# Altium schematic sheet StEth32_modLED_W5500.SchDoc
size A4
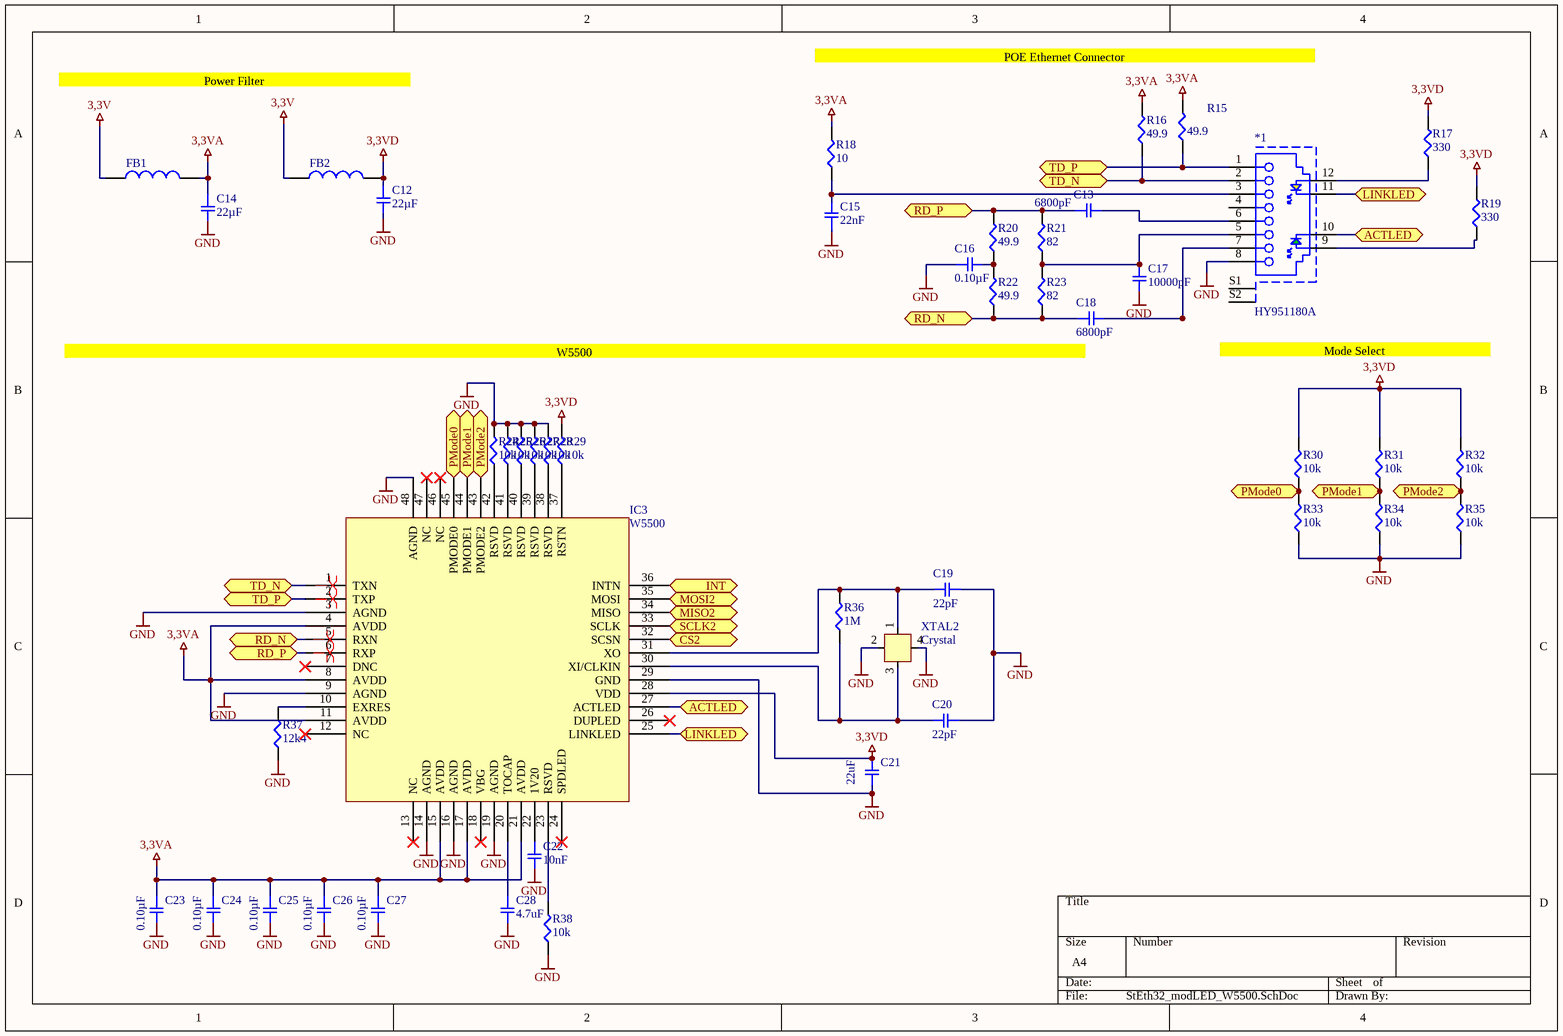
[diagram p0: StEth32_modLED_W5500.SchDoc]

## Parts
*1  HY951180A  [HY951180A]
C12  22µF  [SMD-0603C]
C13  6800pF  [SMD-0603C]
C14  22µF  [SMD-0603C]
C15  22nF  [SMD-0603C]
C16  0.10µF  [SMD-0603C]
C17  10000pF  [SMD-0603C]
C18  6800pF  [SMD-0603C]
C19  22pF  [SMD-0603C]
C20  22pF  [SMD-0603C]
C21  22uF  [SMD-0603C]
C22  10nF  [SMD-0603C]
C23  0.10µF  [SMD-0603C]
C24  0.10µF  [SMD-0603C]
C25  0.10µF  [SMD-0603C]
C26  0.10µF  [SMD-0603C]
C27  0.10µF  [SMD-0603C]
C28  4.7uF  [SMD-0603C]
FB1  600Ohm, 0.2A  [WE-CBF_0805_High Speed]  (value not drawn)
FB2  600Ohm, 0.2A  [WE-CBF_0805_High Speed]  (value not drawn)
IC3  W5500  [LQFP-48]
R15  49.9  [SMD-0603-RES]
R16  49.9  [SMD-0603-RES]
R17  330  [SMD-0603-RES]
R18  10  [SMD-0603-RES]
R19  330  [SMD-0603-RES]
R20  49.9  [SMD-0603-RES]
R21  82  [SMD-0603-RES]
R22  49.9  [SMD-0603-RES]
R23  82  [SMD-0603-RES]
R24  10k  [SMD-0603-RES]
R25  10k  [SMD-0603-RES]
R26  10k  [SMD-0603-RES]
R27  10k  [SMD-0603-RES]
R28  10k  [SMD-0603-RES]
R29  10k  [SMD-0603-RES]
R30  10k  [SMD-0603-RES]
R31  10k  [SMD-0603-RES]
R32  10k  [SMD-0603-RES]
R33  10k  [SMD-0603-RES]
R34  10k  [SMD-0603-RES]
R35  10k  [SMD-0603-RES]
R36  1M  [SMD-0402-RES]
R37  12k4  [SMD-0603-RES]
R38  10k  [SMD-0603-RES]
XTAL2  Crystal  [3225]

## Ports
ACTLED (bidir), CS2 (bidir), INT (bidir), LINKLED (bidir), MISO2 (bidir), MOSI2 (bidir), PMode0 (bidir), PMode1 (bidir), PMode2 (bidir), RD_N (bidir), RD_P (bidir), SCLK2 (bidir), TD_N (bidir), TD_P (bidir)

## Nets
3,3V: FB1.1 FB2.1
3,3VA: C14.1 C23.1 C24.1 C25.1 C26.1 C27.1 FB1.2 IC3.4(AVDD) IC3.8(AVDD) IC3.11(AVDD) IC3.15(AVDD) IC3.17(AVDD) IC3.21(AVDD) R15.2 R16.2 R18.2
3,3VD: C12.1 C21.1 FB2.2 IC3.28(VDD) R17.2 R19.2 R29.2 R30.2 R31.2 R32.2
GND: *1.8 C12.2 C14.2 C15.1 C16.1 C17.2 C19.1 C20.1 C21.2 C22.2 C23.2 C24.2 C25.2 C26.2 C27.2 C28.2 IC3.3(AGND) IC3.9(AGND) IC3.14(AGND) IC3.16(AGND) IC3.19(AGND) IC3.29(GND) IC3.48(AGND) R24.2 R25.2 R26.2 R27.2 R28.2 R33.1 R34.1 R35.1 R37.1 R38.1 XTAL2.2 XTAL2.4
ACTLED: *1.10 IC3.27(ACTLED) ; port ACTLED
CS2: IC3.32(SCSN) ; port CS2
INT: IC3.36(INTN) ; port INT
LINKLED: *1.11 IC3.25(LINKLED) ; port LINKLED
MISO2: IC3.34(MISO) ; port MISO2
MOSI2: IC3.35(MOSI) ; port MOSI2
PMode0: IC3.45(PMODE0) R30.1 R33.2 ; port PMode0
PMode1: IC3.44(PMODE1) R31.1 R34.2 ; port PMode1
PMode2: IC3.43(PMODE2) R32.1 R35.2 ; port PMode2
RD_N: C18.1 IC3.5(RXN) R22.1 R23.1 ; port RD_N
RD_P: C13.1 IC3.6(RXP) R20.2 R21.2 ; port RD_P
SCLK2: IC3.33(SCLK) ; port SCLK2
TD_N: *1.2 IC3.1(TXN) R16.1 ; port TD_N
TD_P: *1.1 IC3.2(TXP) R15.1 ; port TD_P
Net*1_3: *1.3 C15.2 R18.1
Net*1_5: *1.5 C17.1 R21.1 R23.2
Net*1_6: *1.6 C13.2
Net*1_7: *1.7 C18.2
Net*1_9: *1.9 R19.1
Net*1_12: *1.12 R17.1
NetC16_2: C16.2 R20.1 R22.2
NetC19_2: C19.2 IC3.31(XO) R36.2 XTAL2.1
NetC20_2: C20.2 IC3.30(XI/CLKIN) R36.1 XTAL2.3
NetC22_1: C22.1 IC3.22(1V20)
NetC28_1: C28.1 IC3.20(TOCAP)
NetIC3_10: IC3.10(EXRES) R37.2
NetIC3_23: IC3.23(RSVD) R38.2
NetIC3_37: IC3.37(RSTN) R29.1
NetIC3_38: IC3.38(RSVD) R28.1
NetIC3_39: IC3.39(RSVD) R27.1
NetIC3_40: IC3.40(RSVD) R26.1
NetIC3_41: IC3.41(RSVD) R25.1
NetIC3_42: IC3.42(RSVD) R24.1

Not connected (* = marked no-connect by the designer): *1 4 S1 S2; IC3 7(DNC)* 12(NC)* 13(NC)* 18(VBG)* 24(SPDLED)* 26(DUPLED)* 46(NC)* 47(NC)*

## Layout directives
differential pair: (no net found under the mark)

## Notes on the sheet
- Power Filter
- POE Ethernet Connector
- W5500
- (near *1) Mode Select

## Library data of the parts
C12 C14 = ZRB186R60G226ME11L: CAP CER 22UF 4V X5R 0603; Manufacturer: Murata Electronics North America; Factory Stock: 0; Unit Price (USD): 0.36; Minimum Quantity: 1; Tolerance: ±20%; Datasheets: http://psearch.en.murata.com/capacitor/product/ZRB186R60G226ME11%23.pdf; Image: //media.digikey.com/Renders/Murata%20Renders/0603%20(1608%20Metric).jpg; Digi-Key Part Number: 490-13253-1-ND; Part Number: ZRB186R60G226ME11L; Quantity Available: 3925; @ qty: 0; Packaging: Cut Tape (CT); Series: ZRB; Part Status: Active; Value: 22µF; Voltage: 4V; Temperature Coefficient: X5R; Operating Temperature: -55°C ~ 85°C; Features: Interposer Termination; Ratings: -; Applications: Acoustic Noise Reduction; Mounting Type: Surface Mount, MLCC; Package / Case: 0603 (1608 Metric); Size / Dimension: 0.063" L x 0.031" W (1.60mm x 0.80mm); Height - Seated (Max): -; Thickness (Max): 0.031" (0.80mm); Lead Spacing: -; Lead Style: -
C13 C18 = GCM188R71H682KA37D: CAP CER 6800PF 50V X7R 0603; Manufacturer: Murata Electronics North America; Factory Stock: 0; Unit Price (USD): 0.1; Minimum Quantity: 1; Tolerance: ±10%; Datasheets: http://www.murata.com/~/media/webrenewal/support/library/catalog/products/capacitor/mlcc/c03e.ashx; Image: //media.digikey.com/Renders/Murata%20Renders/0603%28GCM188%29.jpg; Digi-Key Part Number: 490-6055-1-ND; Part Number: GCM188R71H682KA37D; Quantity Available: 31753; @ qty: 0; Packaging: Cut Tape (CT); Series: GCM; Part Status: Active; Value: 6800pF; Voltage: 50V; Temperature Coefficient: X7R; Operating Temperature: -55°C ~ 125°C; Features: -; Ratings: AEC-Q200; Applications: Automotive; Mounting Type: Surface Mount, MLCC; Package / Case: 0603 (1608 Metric); Size / Dimension: 0.063" L x 0.031" W (1.60mm x 0.80mm); Height - Seated (Max): -; Thickness (Max): 0.035" (0.90mm); Lead Spacing: -; Lead Style: -
C15 C19 C20 = GCM188R72A223KA37D: CAP CER 0.022UF 100V X7R 0603; Manufacturer: Murata Electronics North America; Factory Stock: 0; Unit Price (USD): 0.11; Minimum Quantity: 1; Tolerance: ±10%; Datasheets: http://www.murata.com/~/media/webrenewal/support/library/catalog/products/capacitor/mlcc/c03e.ashx; Image: //media.digikey.com/Renders/Murata%20Renders/0603%28GCM188%29.jpg; Digi-Key Part Number: 490-4782-1-ND; Part Number: GCM188R72A223KA37D; Quantity Available: 102005; @ qty: 0; Packaging: Cut Tape (CT); Series: GCM; Part Status: Active; Voltage: 100V; Temperature Coefficient: X7R; Operating Temperature: -55°C ~ 125°C; Features: -; Ratings: AEC-Q200; Applications: Automotive; Mounting Type: Surface Mount, MLCC; Package / Case: 0603 (1608 Metric); Size / Dimension: 0.063" L x 0.031" W (1.60mm x 0.80mm); Height - Seated (Max): -; Thickness (Max): 0.035" (0.90mm); Lead Spacing: -; Lead Style: -
  C15: Value: 22nF
  C19 C20: Value: 22pF
C16 C22 = GCJ188R71C104KA01D: CAP CER 0.1UF 16V X7R 0603; Manufacturer: Murata Electronics North America; Factory Stock: 0; Unit Price (USD): 0.21; Minimum Quantity: 1; Tolerance: ±10%; Datasheets: http://www.murata.com/~/media/webrenewal/support/library/catalog/products/capacitor/mlcc/c03e.ashx; Image: //media.digikey.com/Renders/Murata%20Renders/0603%28LQG18%29.jpg; Digi-Key Part Number: 490-5796-1-ND; Part Number: GCJ188R71C104KA01D; Quantity Available: 22473; @ qty: 0; Packaging: Cut Tape (CT); Series: GCJ; Part Status: Active; Voltage: 16V; Temperature Coefficient: X7R; Operating Temperature: -55°C ~ 125°C; Features: Soft Termination; Ratings: AEC-Q200; Applications: Automotive, Boardflex Sensitive; Mounting Type: Surface Mount, MLCC; Package / Case: 0603 (1608 Metric); Size / Dimension: 0.063" L x 0.031" W (1.60mm x 0.80mm); Height - Seated (Max): -; Thickness (Max): 0.035" (0.90mm); Lead Spacing: -; Lead Style: -
  C16: Value: 0.10µF
  C22: Value: 10nF
C17 = GCJ188R71H103KA01D: CAP CER 10000PF 50V X7R 0603; Manufacturer: Murata Electronics North America; Factory Stock: 0; Unit Price (USD): 0.19; Minimum Quantity: 1; Tolerance: ±10%; Datasheets: http://www.murata.com/~/media/webrenewal/support/library/catalog/products/capacitor/mlcc/c03e.ashx; Image: //media.digikey.com/Renders/Murata%20Renders/0603%28LQG18%29.jpg; Digi-Key Part Number: 490-5762-1-ND; Part Number: GCJ188R71H103KA01D; Quantity Available: 34868; @ qty: 0; Packaging: Cut Tape (CT); Series: GCJ; Part Status: Active; Value: 10000pF; Voltage: 50V; Temperature Coefficient: X7R; Operating Temperature: -55°C ~ 125°C; Features: Soft Termination; Ratings: AEC-Q200; Applications: Automotive, Boardflex Sensitive; Mounting Type: Surface Mount, MLCC; Package / Case: 0603 (1608 Metric); Size / Dimension: 0.063" L x 0.031" W (1.60mm x 0.80mm); Height - Seated (Max): -; Thickness (Max): 0.031" (0.80mm); Lead Spacing: -; Lead Style: -
C21 = GCM188R71C104KA37J: CAP CER 0.1UF 16V X7R 0603; Manufacturer: Murata Electronics North America; Factory Stock: 0; Unit Price (USD): 0.18; Minimum Quantity: 1; Tolerance: ±10%; Voltage: 6.3V; Datasheets: http://www.murata.com/~/media/webrenewal/support/library/catalog/products/capacitor/mlcc/c03e.ashx; Image: //media.digikey.com/Renders/Murata%20Renders/0603%28GCM188%29.jpg; Digi-Key Part Number: 490-8015-1-ND; Part Number: GCM188R71C104KA37J; Quantity Available: 17844; @ qty: 0; Packaging: Cut Tape (CT); Series: GCM; Part Status: Active; Value: 22uF; Temperature Coefficient: X7R; Operating Temperature: -55°C ~ 125°C; Features: -; Ratings: AEC-Q200; Applications: Automotive; Mounting Type: Surface Mount, MLCC; Package / Case: 0603 (1608 Metric); Size / Dimension: 0.063" L x 0.031" W (1.60mm x 0.80mm); Height - Seated (Max): -; Thickness (Max): 0.035" (0.90mm); Lead Spacing: -; Lead Style: -
C23-C27 = GCM188R71C104KA37J: CAP CER 0.1UF 16V X7R 0603; Manufacturer: Murata Electronics North America; Factory Stock: 0; Unit Price (USD): 0.18; Minimum Quantity: 1; Tolerance: ±10%; Datasheets: http://www.murata.com/~/media/webrenewal/support/library/catalog/products/capacitor/mlcc/c03e.ashx; Image: //media.digikey.com/Renders/Murata%20Renders/0603%28GCM188%29.jpg; Digi-Key Part Number: 490-8015-1-ND; Part Number: GCM188R71C104KA37J; Quantity Available: 17844; @ qty: 0; Packaging: Cut Tape (CT); Series: GCM; Part Status: Active; Value: 0.10µF; Voltage: 16V; Temperature Coefficient: X7R; Operating Temperature: -55°C ~ 125°C; Features: -; Ratings: AEC-Q200; Applications: Automotive; Mounting Type: Surface Mount, MLCC; Package / Case: 0603 (1608 Metric); Size / Dimension: 0.063" L x 0.031" W (1.60mm x 0.80mm); Height - Seated (Max): -; Thickness (Max): 0.035" (0.90mm); Lead Spacing: -; Lead Style: -
C28 = GCJ188R71C104KA01D: CAP CER 0.1UF 16V X7R 0603; Manufacturer: Murata Electronics North America; Factory Stock: 0; Unit Price (USD): 0.21; Minimum Quantity: 1; Tolerance: ±10%; Voltage: 6.3V; Datasheets: http://www.murata.com/~/media/webrenewal/support/library/catalog/products/capacitor/mlcc/c03e.ashx; Image: //media.digikey.com/Renders/Murata%20Renders/0603%28LQG18%29.jpg; Digi-Key Part Number: 490-5796-1-ND; Part Number: GCJ188R71C104KA01D; Quantity Available: 22473; @ qty: 0; Packaging: Cut Tape (CT); Series: GCJ; Part Status: Active; Value: 4.7uF; Temperature Coefficient: X7R; Operating Temperature: -55°C ~ 125°C; Features: Soft Termination; Ratings: AEC-Q200; Applications: Automotive, Boardflex Sensitive; Mounting Type: Surface Mount, MLCC; Package / Case: 0603 (1608 Metric); Size / Dimension: 0.063" L x 0.031" W (1.60mm x 0.80mm); Height - Seated (Max): -; Thickness (Max): 0.035" (0.90mm); Lead Spacing: -; Lead Style: -
FB1 FB2 = 742792042: WE-CBF SMT EMI Suppression Ferrite Bead, size 0805, 600Ohm, 0.2A; Impedance max.: 3000Ohm; DC Resistance max.: 0.5Ohm; Type: High Speed; ComponentLink1Description: Manufacturer; ComponentLink1URL: http://www.we-online.de; ComponentLink2Description: Datasheet; ComponentLink2URL: https://katalog.we-online.com/pbs/datasheet/742792042.pdf; Part Number: 742792042; Published Date: March 2019; Publisher: Wurth Elektronik; Rated Current: 0.2A; Operating Temperature: -55 to +125degC; Impedance@100 MHz: 600Ohm; Mounting Technology: SMT; Packaging: Tape and Reel; Size: 0805
R15 R16 R20 R22 = ERJ-3EKF49R9V: RES SMD 49.9 OHM 1% 1/10W 0603; Manufacturer: Panasonic Electronic Components; Factory Stock: 0; Unit Price (USD): 0.00379; @ qty: 1500; Minimum Quantity: 1; Power (Watts): 0.1W, 1/10W; Temperature Coefficient: ±100ppm/°C; Part Number: ERJ-3EKF49R9V; Datasheets: http://industrial.panasonic.com/www-cgi/jvcr13pz.cgi?E+PZ+3+AOA0002+ERJ3EKF49R9V+7+WW; Image: //media.digikey.com/Photos/Panasonic%20Photos/MFG_ERJ-P6W%20Series.jpg; Digi-Key Part Number: P49.9HCT-ND; Quantity Available: 566023; Packaging: Cut Tape (CT); Series: ERJ; Part Status: Active; Value: 49.9; Tolerance: ±1%; Composition: Thick Film; Features: Automotive AEC-Q200; Operating Temperature: -55°C ~ 155°C; Package / Case: 0603 (1608 Metric); Supplier Device Package: 0603; Size / Dimension: 0.063" L x 0.031" W (1.60mm x 0.80mm); Height - Seated (Max): 0.022" (0.55mm); Number of Terminations: 2; Failure Rate: -
R17-R19 = ERJ-3EKF3300V: RES SMD 330 OHM 1% 1/10W 0603; Manufacturer: Panasonic Electronic Components; Factory Stock: 0; Unit Price (USD): 0.00379; @ qty: 1500; Minimum Quantity: 1; Power (Watts): 0.1W, 1/10W; Temperature Coefficient: ±100ppm/°C; Part Number: ERJ-3EKF3300V; Datasheets: http://industrial.panasonic.com/www-cgi/jvcr13pz.cgi?E+PZ+3+AOA0002+ERJ3EKF3300V+7+WW; Image: //media.digikey.com/Photos/Panasonic%20Photos/MFG_ERJ-P6W%20Series.jpg; Digi-Key Part Number: P330HCT-ND; Quantity Available: 670984; Packaging: Cut Tape (CT); Series: ERJ; Part Status: Active; Tolerance: ±1%; Composition: Thick Film; Features: Automotive AEC-Q200; Operating Temperature: -55°C ~ 155°C; Package / Case: 0603 (1608 Metric); Supplier Device Package: 0603; Size / Dimension: 0.063" L x 0.031" W (1.60mm x 0.80mm); Height - Seated (Max): 0.022" (0.55mm); Number of Terminations: 2; Failure Rate: -
  R17 R19: Value: 330
  R18: Value: 10
R21 R23 = ERJ-3EKF49R9V: RES SMD 49.9 OHM 1% 1/10W 0603; Manufacturer: Panasonic Electronic Components; Factory Stock: 0; Unit Price (USD): 0.00379; @ qty: 1500; Minimum Quantity: 1; Value: 49.9; Power (Watts): 0.1W, 1/10W; Temperature Coefficient: ±100ppm/°C; Part Number: ERJ-3EKF49R9V; Datasheets: http://industrial.panasonic.com/www-cgi/jvcr13pz.cgi?E+PZ+3+AOA0002+ERJ3EKF49R9V+7+WW; Image: //media.digikey.com/Photos/Panasonic%20Photos/MFG_ERJ-P6W%20Series.jpg; Digi-Key Part Number: P49.9HCT-ND; Quantity Available: 566023; Packaging: Cut Tape (CT); Series: ERJ; Part Status: Active; Tolerance: ±1%; Composition: Thick Film; Features: Automotive AEC-Q200; Operating Temperature: -55°C ~ 155°C; Package / Case: 0603 (1608 Metric); Supplier Device Package: 0603; Size / Dimension: 0.063" L x 0.031" W (1.60mm x 0.80mm); Height - Seated (Max): 0.022" (0.55mm); Number of Terminations: 2; Failure Rate: -
R24-R35 R38 = ERJ-3EKF1002V: RES SMD 10K OHM 1% 1/10W 0603; Manufacturer: Panasonic Electronic Components; Factory Stock: 0; Unit Price (USD): 0.00379; @ qty: 1500; Minimum Quantity: 1; Power (Watts): 0.1W, 1/10W; Temperature Coefficient: ±100ppm/°C; Part Number: ERJ-3EKF1002V; Datasheets: http://industrial.panasonic.com/www-cgi/jvcr13pz.cgi?E+PZ+3+AOA0002+ERJ3EKF1002V+7+WW; Image: //media.digikey.com/Photos/Panasonic%20Photos/MFG_ERJ-P6W%20Series.jpg; Digi-Key Part Number: P10.0KHCT-ND; Quantity Available: 6703141; Packaging: Cut Tape (CT); Series: ERJ; Part Status: Active; Value: 10k; Tolerance: ±1%; Composition: Thick Film; Features: Automotive AEC-Q200; Operating Temperature: -55°C ~ 155°C; Package / Case: 0603 (1608 Metric); Supplier Device Package: 0603; Size / Dimension: 0.063" L x 0.031" W (1.60mm x 0.80mm); Height - Seated (Max): 0.022" (0.55mm); Number of Terminations: 2; Failure Rate: -
R36 = ERJ-2GEJ105X: RES SMD 1M OHM 5% 1/10W 0402; Manufacturer: Panasonic Electronic Components; Factory Stock: 0; Unit Price (USD): 0.00350; @ qty: 1500; Minimum Quantity: 1; Power (Watts): 0.1W, 1/10W; Temperature Coefficient: ±200ppm/°C; Part Number: ERJ-2GEJ105X; Datasheets: http://industrial.panasonic.com/www-cgi/jvcr13pz.cgi?E+PZ+3+AOA0001+ERJ2GEJ105X+7+WW; Image: //media.digikey.com/Photos/Panasonic%20Photos/ERJ-PA2-Series.jpg; Digi-Key Part Number: P1.0MJCT-ND; Quantity Available: 1082572; Packaging: Cut Tape (CT); Series: ERJ; Part Status: Active; Value: 1M; Tolerance: ±5%; Composition: Thick Film; Features: Automotive AEC-Q200; Operating Temperature: -55°C ~ 155°C; Package / Case: 0402 (1005 Metric); Supplier Device Package: 0402; Size / Dimension: 0.039" L x 0.020" W (1.00mm x 0.50mm); Height - Seated (Max): 0.016" (0.40mm); Number of Terminations: 2; Failure Rate: -
R37 = ERJ-3BQF1R1V: RES SMD 12,4 KOHM 1% 1/4W 0603; Manufacturer: Panasonic Electronic Components; Factory Stock: 0; Unit Price (USD): 0.05386; @ qty: 1500; Minimum Quantity: 1; Power (Watts): 0.25W, 1/4W; Temperature Coefficient: ±200ppm/°C; Part Number: ERJ-3BQF1R1V; Datasheets: https://industrial.panasonic.com/cdbs/www-data/pdf/RDA0000/AOA0000C239.pdf; Image: //media.digikey.com/Photos/Panasonic%20Photos/MFG_ERJ-P6W%20Series.jpg; Digi-Key Part Number: P17372CT-ND; Quantity Available: 3896; Packaging: Cut Tape (CT); Series: ERJ; Part Status: Active; Value: 12k4; Tolerance: ±1%; Composition: Thick Film; Features: Automotive AEC-Q200, Current Sense; Operating Temperature: -55°C ~ 125°C; Package / Case: 0603 (1608 Metric); Supplier Device Package: 0603; Size / Dimension: 0.063" L x 0.031" W (1.60mm x 0.80mm); Height - Seated (Max): 0.022" (0.55mm); Number of Terminations: 2; Failure Rate: -
XTAL2 = 3225